# Altium schematic sheet Connector.SchDoc: RB25DET - Connector
size A4; Address1: Drawn By:; Address2: Dan Visser; DocumentNumber: A; Revision: 0.1; SheetNumber: 12; SheetTotal: 12
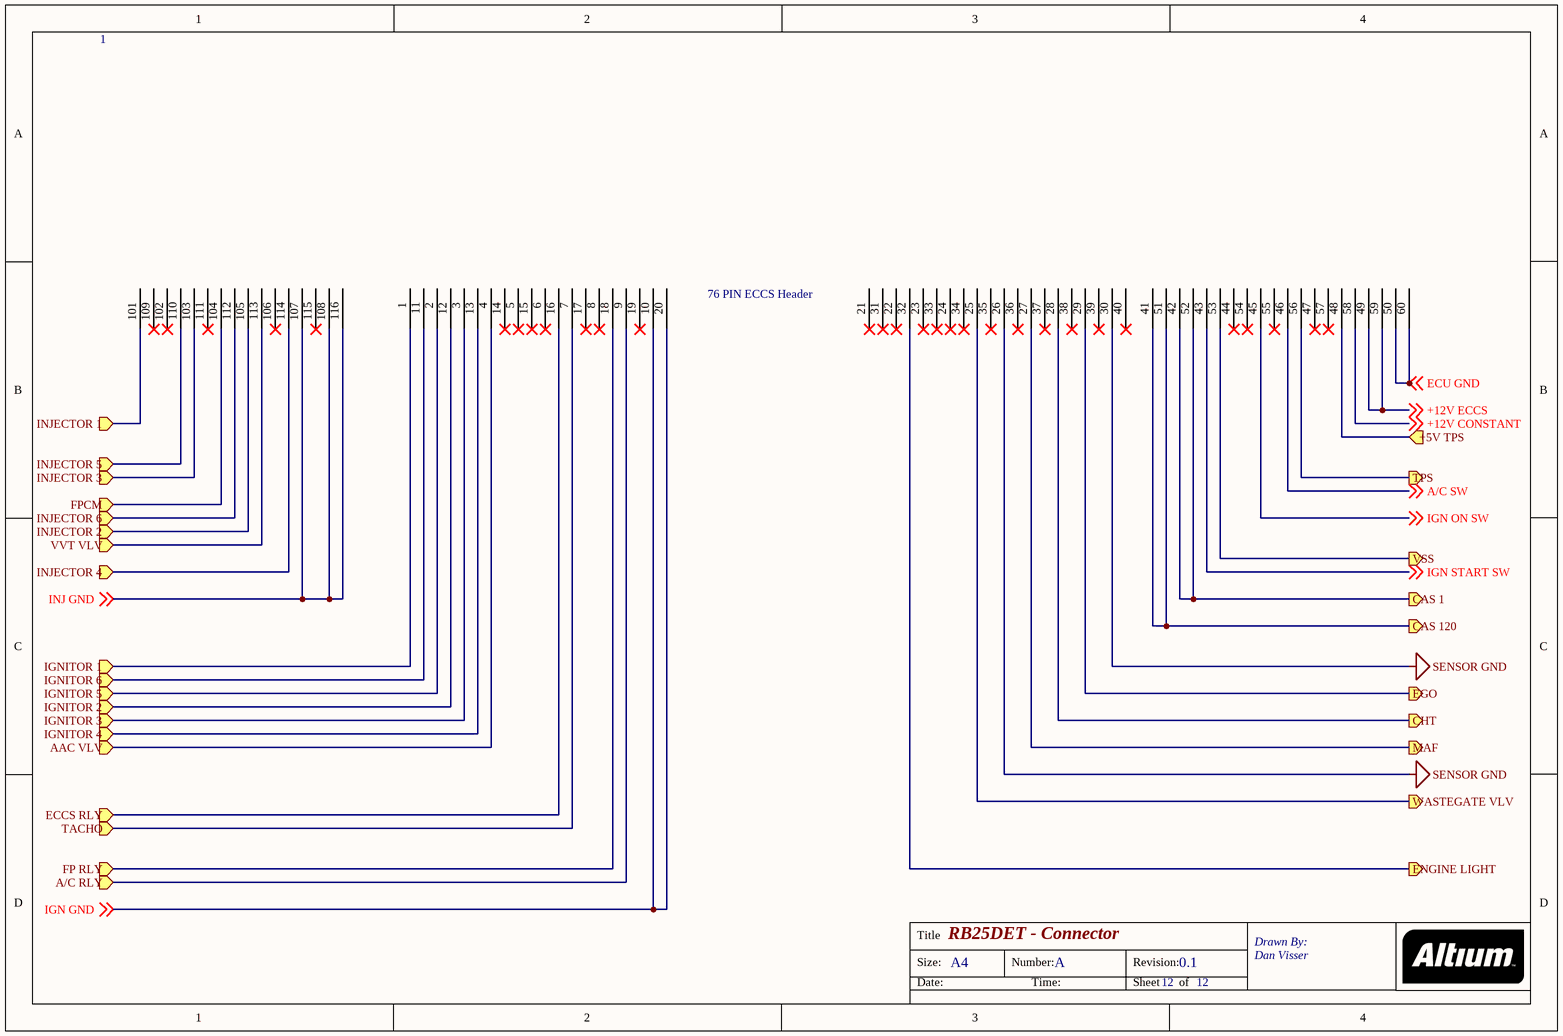
[diagram p0: Connector.SchDoc]

## Parts
1  76 PIN ECCS Header

## Ports
+5V TPS (in), A/C RLY (in), AAC VLV (in), CAS 1 (out), CAS 120 (out), CHT (out), ECCS RLY (in), EGO (out), ENGINE LIGHT (out), FP RLY (in), FPCM (in), IGNITOR 1 (in), IGNITOR 2 (in), IGNITOR 3 (in), IGNITOR 4 (in), IGNITOR 5 (in), IGNITOR 6 (in), INJECTOR 1 (in), INJECTOR 2 (in), INJECTOR 3 (in), INJECTOR 4 (in), INJECTOR 5 (in), INJECTOR 6 (in), MAF (out), TACHO (in), TPS (out), VSS (out), VVT VLV (in), WASTEGATE VLV (out)

## Nets
SENSOR GND: 1.26 1.30
+5V TPS: 1.48 ; port +5V TPS
+12V CONSTANT: 1.58 ; off-sheet +12V CONSTANT
+12V ECCS: 1.49 1.59 ; off-sheet +12V ECCS
A/C RLY: 1.9 ; port A/C RLY
A/C SW: 1.46 ; off-sheet A/C SW
AAC VLV: 1.4 ; port AAC VLV
CAS 1: 1.42 1.52 ; port CAS 1
CAS 120: 1.41 1.51 ; port CAS 120
CHT: 1.28 ; port CHT
ECCS RLY: 1.16 ; port ECCS RLY
ECU GND: 1.50 1.60 ; off-sheet ECU GND
EGO: 1.29 ; port EGO
ENGINE LIGHT: 1.32 ; port ENGINE LIGHT
FP RLY: 1.18 ; port FP RLY
FPCM: 1.104 ; port FPCM
IGN GND: 1.10 1.20 ; off-sheet IGN GND
IGN ON SW: 1.45 ; off-sheet IGN ON SW
IGN START SW: 1.43 ; off-sheet IGN START SW
IGNITOR 1: 1.1 ; port IGNITOR 1
IGNITOR 2: 1.12 ; port IGNITOR 2
IGNITOR 3: 1.3 ; port IGNITOR 3
IGNITOR 4: 1.13 ; port IGNITOR 4
IGNITOR 5: 1.2 ; port IGNITOR 5
IGNITOR 6: 1.11 ; port IGNITOR 6
INJ GND: 1.107 1.108 1.116 ; off-sheet INJ GND
INJECTOR 1: 1.101 ; port INJECTOR 1
INJECTOR 2: 1.105 ; port INJECTOR 2
INJECTOR 3: 1.103 ; port INJECTOR 3
INJECTOR 4: 1.114 ; port INJECTOR 4
INJECTOR 5: 1.110 ; port INJECTOR 5
INJECTOR 6: 1.112 ; port INJECTOR 6
MAF: 1.27 ; port MAF
TACHO: 1.7 ; port TACHO
TPS: 1.56 ; port TPS
VSS: 1.53 ; port VSS
VVT VLV: 1.113 ; port VVT VLV
WASTEGATE VLV: 1.25 ; port WASTEGATE VLV

Not connected (* = marked no-connect by the designer): 1 5* 6* 8* 14* 15* 17* 19* 21* 22* 23* 24* 31* 33* 34* 35* 36* 37* 38* 39* 40* 44* 47* 54* 55* 57* 102* 106* 109* 111* 115*

## Notes on the sheet
- Title
- Size:
- Date:
- A4
- Number:
- Time:
- Revision:
- Sheet
- of